# Altium schematic sheet I2C extender 1.SchDoc
size A4; SheetNumber: 6; SheetTotal: 6
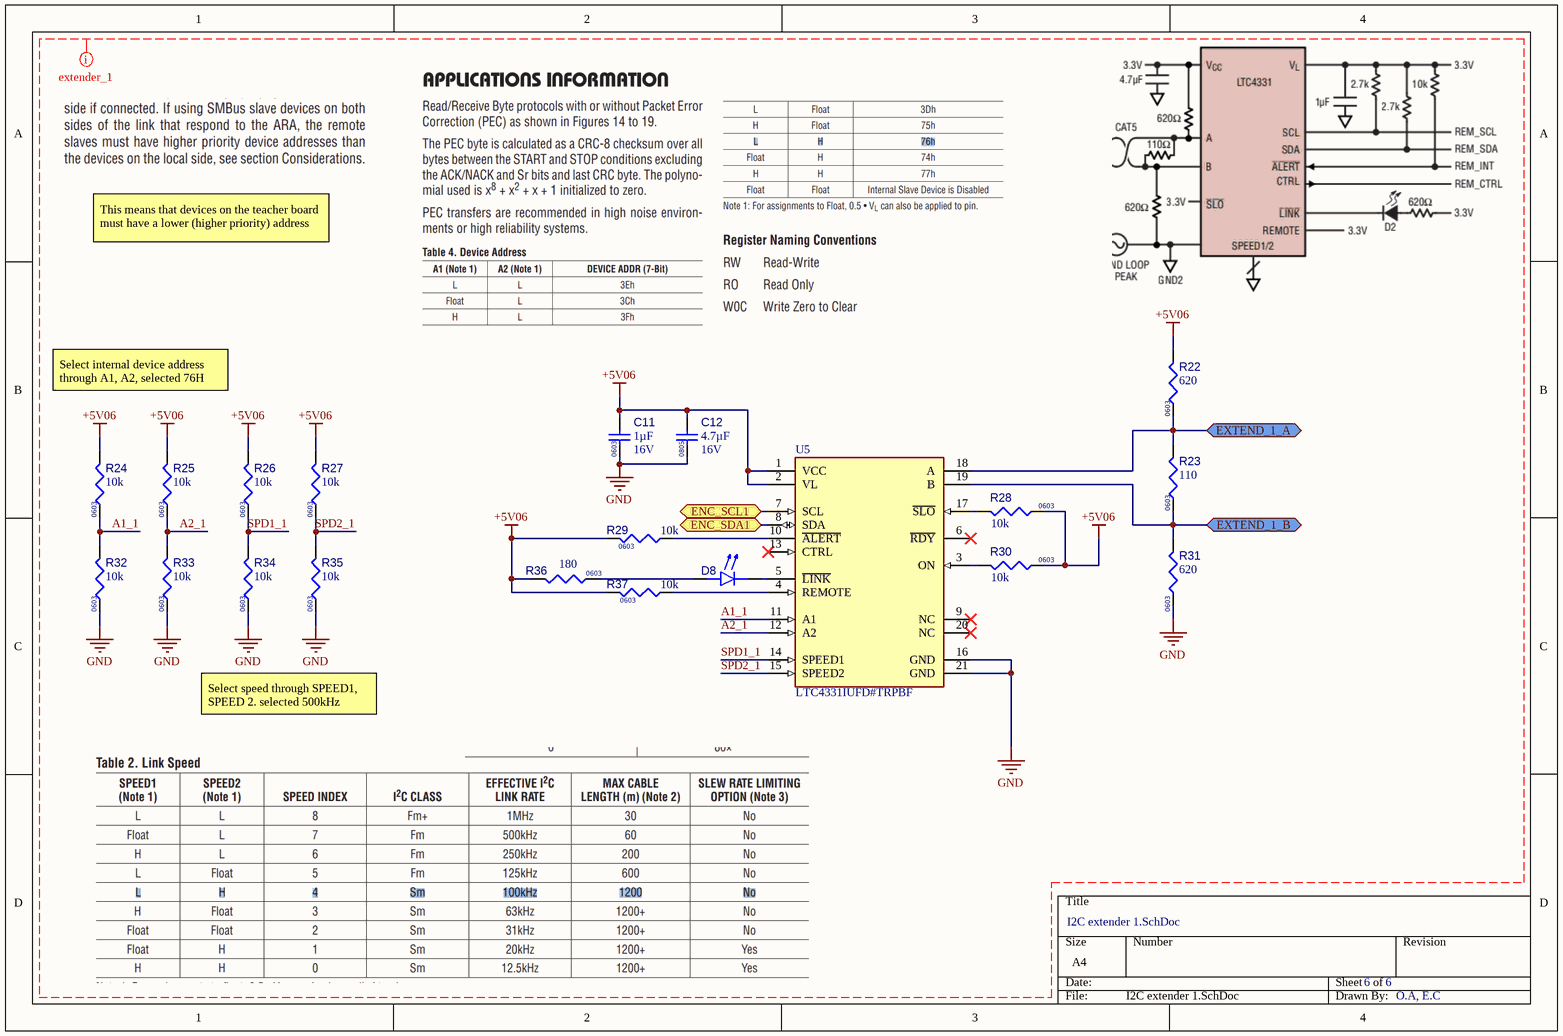
[diagram p0: I2C extender 1.SchDoc]

## Parts
C11  value 1µF  Case/Package: 0603  Voltage Rating: 16V  [CAPC1608X90X35NL15T15]  (hidden comment: Capacitor 1uF +/- 10% 16V 0603)
C12  value 4.7µF  Case/Package: 0805  Rated DC Voltage (URdc): 16V  [CL21A475KOFNNNE-Footprint-1]  (hidden comment: CL21A475KOFNNNE)
D8  150060YS75000  [WL-SMCW_0603_150060xx75000]  (value not drawn)
R22  value 620  Case/Package: 0603  [RC0603JR-0720KL-Footprint-1]  (hidden comment: RC0603FR-07620RL)
R23  value 110  Case/Package: 0603  [RC0603JR-0720KL-Footprint-1]  (hidden comment: RC0603FR-07110RL)
R24  value 10k  Case/Package: 0603  [RESC1608X55X25NL10T15]  (hidden comment: Resistor 10k +/-1% 0603 100 mW)
R25  value 10k  Case/Package: 0603  [RESC1608X55X25NL10T15]  (hidden comment: Resistor 10k +/-1% 0603 100 mW)
R26  value 10k  Case/Package: 0603  [RESC1608X55X25NL10T15]  (hidden comment: Resistor 10k +/-1% 0603 100 mW)
R27  value 10k  Case/Package: 0603  [RESC1608X55X25NL10T15]  (hidden comment: Resistor 10k +/-1% 0603 100 mW)
R28  value 10k  Case/Package: 0603  [RESC1608X55X25NL10T15]  (hidden comment: Resistor 10k +/-1% 0603 100 mW)
R29  value 10k  Case/Package: 0603  [RESC1608X55X25NL10T15]  (hidden comment: Resistor 10k +/-1% 0603 100 mW)
R30  value 10k  Case/Package: 0603  [RESC1608X55X25NL10T15]  (hidden comment: Resistor 10k +/-1% 0603 100 mW)
R31  value 620  Case/Package: 0603  [RC0603JR-0720KL-Footprint-1]  (hidden comment: RC0603FR-07620RL)
R32  value 10k  Case/Package: 0603  [RESC1608X55X25NL10T15]  (hidden comment: Resistor 10k +/-1% 0603 100 mW)
R33  value 10k  Case/Package: 0603  [RESC1608X55X25NL10T15]  (hidden comment: Resistor 10k +/-1% 0603 100 mW)
R34  value 10k  Case/Package: 0603  [RESC1608X55X25NL10T15]  (hidden comment: Resistor 10k +/-1% 0603 100 mW)
R35  value 10k  Case/Package: 0603  [RESC1608X55X25NL10T15]  (hidden comment: Resistor 10k +/-1% 0603 100 mW)
R36  value 180  Case/Package: 0603  [RESC0603(1608)_N]  (hidden comment: RC0603JR-07180RL)
R37  value 10k  Case/Package: 0603  [RESC1608X55X25NL10T15]  (hidden comment: Resistor 10k +/-1% 0603 100 mW)
U5  LTC4331IUFD#TRPBF  [FP-UFD-20-05-08-1711-IPC_C]

## Ports
ENC_SCL1 (bidir), ENC_SDA1 (bidir), EXTEND_1_A (bidir), EXTEND_1_B (bidir)

## Nets
+5V06: C11.2 C12.2 R22.2 R24.2 R25.2 R26.2 R27.2 R28.1 R29.1 R30.1 R36.2 R37.1 U5.1(VCC) U5.2(VL)
GND: C11.1 C12.1 R31.1 R32.1 R33.1 R34.1 R35.1 U5.16(GND) U5.21(GND)
A1_1: R24.1 R32.2 U5.11(A1)
A2_1: R25.1 R33.2 U5.12(A2)
ENC_SCL1: U5.7(SCL) ; port ENC_SCL1
ENC_SDA1: U5.8(SDA) ; port ENC_SDA1
EXTEND_1_A: R22.1 R23.2 U5.18(A) ; port EXTEND_1_A
EXTEND_1_B: R23.1 R31.2 U5.19(B) ; port EXTEND_1_B
SPD1_1: R26.1 R34.2 U5.14(SPEED1)
SPD2_1: R27.1 R35.2 U5.15(SPEED2)
NetD8_1: D8.1(K) U5.5(~{LINK})
NetD8_2: D8.2(A) R36.1
NetR28_2: R28.2 U5.17(~{SLO})
NetR29_2: R29.2 U5.10(~{ALERT})
NetR30_2: R30.2 U5.3(ON)
NetR37_2: R37.2 U5.4(REMOTE)

Not connected (* = marked no-connect by the designer): U5 6(~{RDY})* 9(NC)* 13(CTRL)* 20(NC)*

## Layout directives
mark named extender_1: +5V06, A1_1, A2_1, GND, SPD1_1, SPD2_1

## Notes on the sheet
- This means that devices on the teacher board must have a lower (higher priority) address
- Select internal device address through A1, A2, selected 76H
- Select speed through SPEED1, SPEED 2. selected 500kHz
- O.A, E.C

## Library data of the parts
C11 = CMP-001-00004-8: Chip Capacitor, 1 uF, +/- 10%, 16 V, 0603 (1608 Metric); Capacitor Type: Ceramic; Mounting Technology: SM; RoHS Compliant: True; Min Operating Temperature: -55°C; Pins: 2; Max Operating Temperature: 125°C; Tolerance: 10%
C12 = CMP-001-00089-2: Ceramic Capacitor, Multilayer, Ceramic, 16V, 10% +Tol, 10% -Tol, X5R, 15% TC, 4.7uF, Surface Mount, 0805; Multilayer: Yes; Dielectric Material: Ceramic; Tolerance (fill in as +-): 10%; Pins: 2; Package Style: SMTMeter; Max Operating Temperature: 85°C; JESD-609 Code: e3; Termination: Wraparound; Min Operating Temperature: -55°C; RoHS Compliant: Yes; Mounting Technology: Surface Mount; Reach SVHC Compliant: Yes; Terminal Finish: Nickel; Packaging: Tape and Reel; Capacitor Type: Ceramic; Height: 1.35mm; Width: 1.25mm; Temperature Characteristics Code: X5R; Length: 2mm; Tolerance  (fill in as +-): 10%; Package Shape: Rectangular
D8 = CMP-007-00046-1: Single Color LED, Yellow, Water Clear, 1.1mm; Shape: Rectangular; Forward Current: 30mA; Forward Voltage: 2V; Viewing Angle: 140°; Channels: 1; Luminous Intensity-Nom: 120mcd; Overall Height: 0.7mm; Packaging: Tape and Reel; Size: 1.1mm; Max Operating Temperature: 85°C; RoHS Compliant: Yes; Color: Yellow; Pins: 2; Lens Style: WATER CLEAR; Reach SVHC Compliant: Yes; Terminal Pitch: 1.6mm; Mounting Technology: Surface Mount; Min Operating Temperature: -40°C; Optoelectronic Device Type: SINGLE COLOR LED
R22 R31 = CMP-009-00191-1: Fixed Resistor, Metal Glaze/thick Film, 0.1W, 620ohm, 75V, 1% +/-Tol, 100ppm/Cel, Surface Mount, 0603; Power: 100mW; Additional Feature: LASER TRIMMABLE; Package Height: 0.45mm; Package Width: 0.8mm; Temperature Coefficient: 100ppm/°C; Rated Temperature: 70°C; Package Length: 1.6mm; Package Shape: Rectangular; Min Operating Temperature: -55°C; Technology: METAL GLAZE/THICK FILM; Reach SVHC Compliant: Yes; Pins: 2; Working Voltage: 75V; Tolerance: 1%; Terminal Finish: Nickel; RoHS Compliant: Yes; Termination: Wraparound; Construction: Chip; JESD-609 Code: e3; Mounting Technology: Surface Mount; Max Operating Temperature: 155°C; Package Style: SMTMeter; Packaging: Tape and Reel; Resistor Type: FIXED RESISTOR
R23 = CMP-009-00190-1: Fixed Resistor, Metal Glaze/thick Film, 0.1W, 110ohm, 75V, 1% +/-Tol, 100ppm/Cel, Surface Mount, 0603; Package Length: 1.6mm; Temperature Coefficient: 100ppm/°C; Power: 100mW; Package Height: 0.45mm; Package Width: 0.8mm; Additional Feature: LASER TRIMMABLE; Rated Temperature: 70°C; Termination: Wraparound; JESD-609 Code: e3; RoHS Compliant: Yes; Tolerance: 1%; Max Operating Temperature: 155°C; Package Style: SMTMeter; Terminal Finish: Nickel; Packaging: Tape and Reel; Package Shape: Rectangular; Pins: 2; Working Voltage: 75V; Construction: Chip; Resistor Type: FIXED RESISTOR; Technology: METAL GLAZE/THICK FILM; Reach SVHC Compliant: Yes; Mounting Technology: Surface Mount; Min Operating Temperature: -55°C
R24-R30 R32-R35 R37 = CMP-009-00017-7: Chip Resistor, 10 KOhm, +/- 1%, 01 W, -55 to 155 degC, 0603 (1608 Metric); Voltage Rating: 50V; Power: 100mW; RoHS Compliant: True; Min Operating Temperature: -55°C; Pins: 2; Mounting Technology: SM; Max Operating Temperature: 155°C; Tolerance: 1%
R36 = CMP-009-00178-1: Fixed Resistor, Metal Glaze/thick Film, 0.1W, 180ohm, 75V, 5% +/-Tol, 100ppm/Cel, Surface Mount, 0603; Power: 100mW; Tolerance: 5%; Pins: 2; Mounting Technology: Surface Mount; RoHS Compliant: Yes; Max Operating Temperature: 155°C; Min Operating Temperature: -55°C
U5 = CMP-015-00011-1: Interface Circuit, CMOS, PQCC20; Throw Configuration: POWER SUPPLY SUPPORT CIRCUIT; Reach SVHC Compliant: Yes; RoHS Compliant: Yes